# Altium project İHA-PDU.PrjPcb (part 5 of 13)
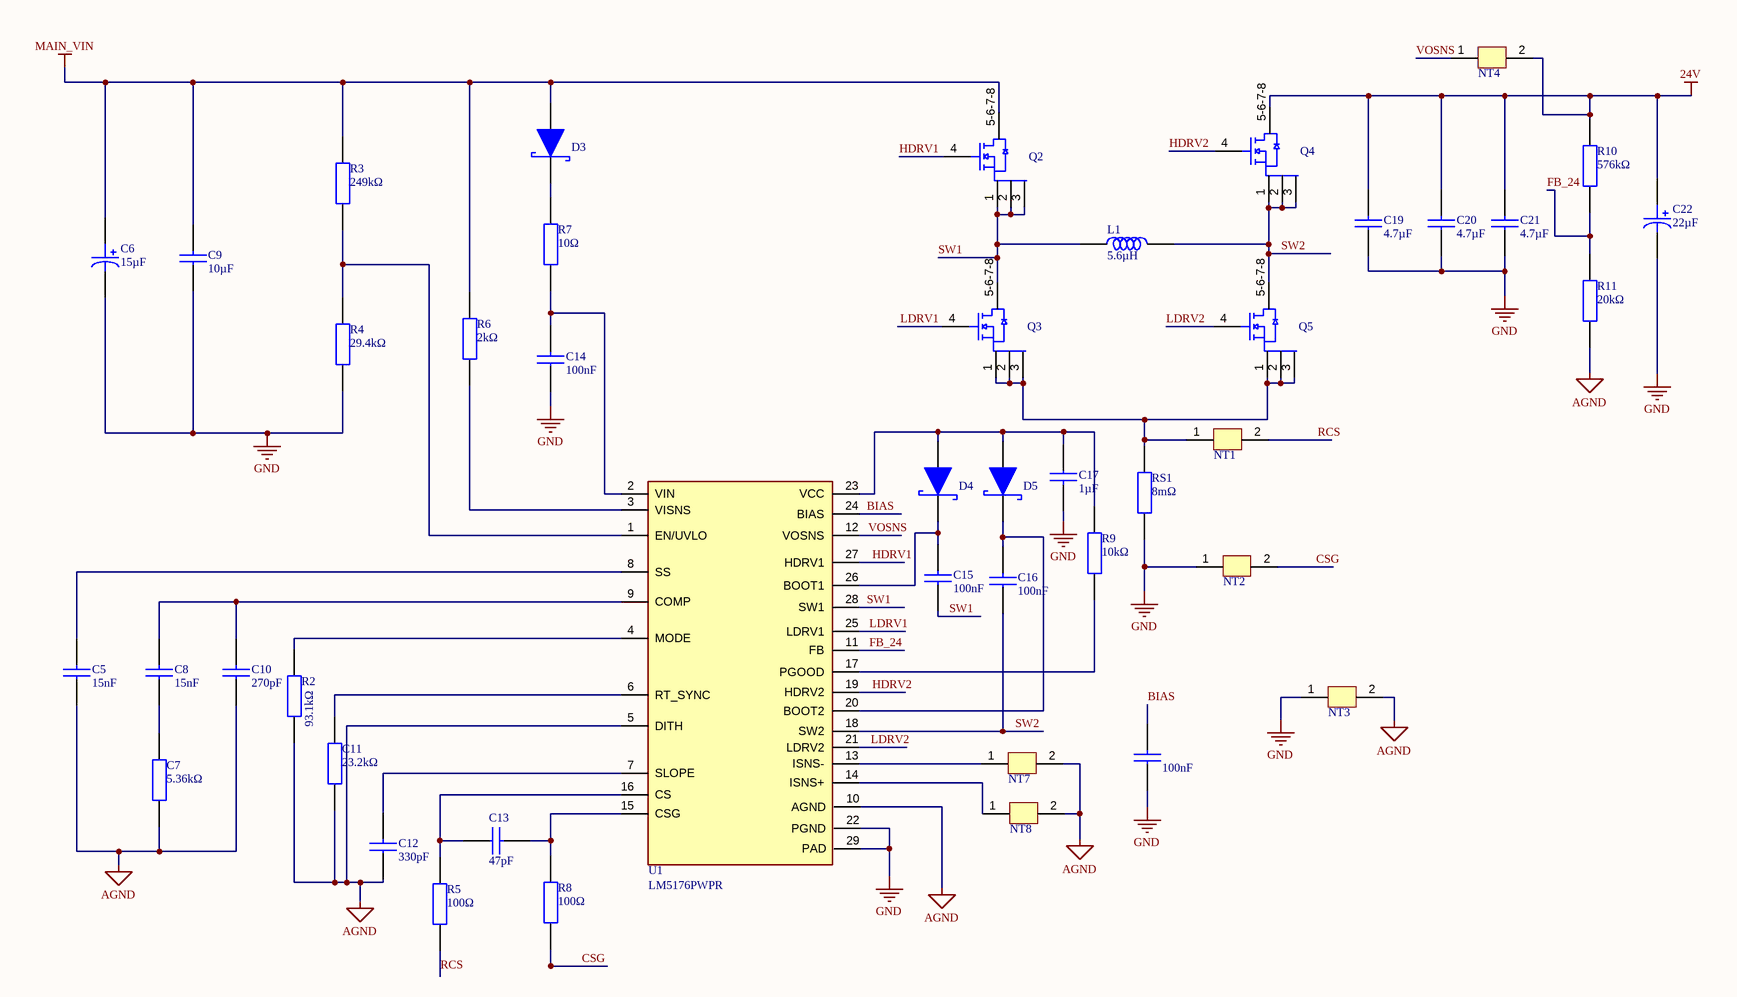
[diagram p11: 24V_Main_Regulator.SchDoc]

## Sheet 24V_Main_Regulator.SchDoc (continued)

### Library data of the parts (continued)
R6 = CRCW06032K00FKEA: 100mW Thick Film Resistors 100V ±1% ±100ppm/℃ 2kΩ 0603 Chip Resistor - Surface Mount ROHS; Manufacturer: Vishay; Temperature Coefficient: 100ppm/°C; Voltage Rating: 75V; Supplier: Farnell; Supplier Part Number: CRCW06032K00FKEA; Manufacturer Part Number: CRCW06032K00FKEA; RoHS: Compliant; Category: Chip SMD Resistors; Stock: 1445000; Pricing: 5000=0,0098 (EUR); Case/Package: 0603; Case Code (Imperial): 0603; China RoHS: Non-Compliant; Composition: Thick Film; Contact Plating: Lead, Tin; Country of Origin: Israel, Taiwan; Depth: 850µm; Export Control Classification Number (ECCN) Code: EAR99; Features: Automotive AEC-Q200; Height: 450µm; Harmonized Tariff Schedule (HTS) Code: 8533.21.00.30; Introduction Date: 2005-02-16; Lead Free: Lead Free; Length: 1.55mm; Lifecycle Status: Production; Max Operating Temperature: 155°C; Max Power Dissipation: 100mW; Military Standard: Not; Min Operating Temperature: -55°C; Mounting Technology: Surface Mount; Pins: 2; Number of Terminals: 2; Number of Terminations: 2; Packaging: Cut Tape; Power Rating: 100mW; Radiation Hardening: No; Ratings: AEC-Q200; REACH SVHC: Yes; Schedule B: 8533210045, 8533210045|8533210045|8533210045|8533210045|8533210045|8533210045|8533210045|8533210045|8533210045|8533210045|8533210045|8533210045|8533210045|8533210045|8533210045|8533210045|8533210045|8533210045|8533210045|8533210045|8533210045|8533210045|8533210045|85; Termination: Solder; Tolerance: 1%; Voltage Rating (DC): 75V; Weight: 2.012816mg; Width: 850µm; Working Voltage: 75V; ComponentLink1URL: https://datasheet.octopart.com:443/CRCW06032K00FKEA-Vishay-datasheet-175423584.pdf?src-supplier=IHS; ComponentLink1Description: https://datasheet.octopart.com:443/CRCW06032K00FKEA-Vishay-datasheet-175423584.pdf?src-supplier=IHS; ComponentLink2URL: https://datasheet.octopart.com:443/CRCW06032K00FKEA-Vishay-datasheet-62316122.pdf?src-supplier=Future+Electronics; ComponentLink2Description: https://datasheet.octopart.com:443/CRCW06032K00FKEA-Vishay-datasheet-62316122.pdf?src-supplier=Future+Electronics; ComponentLink3URL: https://datasheet.octopart.com:443/CRCW06032K00FKEA-Vishay-datasheet-5300368.pdf?src-supplier=Future+Electronics; ComponentLink3Description: https://datasheet.octopart.com:443/CRCW06032K00FKEA-Vishay-datasheet-5300368.pdf?src-supplier=Future+Electronics; ComponentLink4URL: https://datasheet.octopart.com:443/CRCW06032K00FKEA-Vishay-datasheet-83961561.pdf?src-supplier=element14+APAC; ComponentLink4Description: https://datasheet.octopart.com:443/CRCW06032K00FKEA-Vishay-datasheet-83961561.pdf?src-supplier=element14+APAC; ComponentLink5URL: https://datasheet.octopart.com:443/CRCW06032K00FKEA-Vishay-datasheet-62317933.pdf?src-supplier=element14+APAC; ComponentLink5Description: https://datasheet.octopart.com:443/CRCW06032K00FKEA-Vishay-datasheet-62317933.pdf?src-supplier=element14+APAC; ComponentLink6URL: https://datasheet.octopart.com:443/CRCW06032K00FKEA-Vishay-datasheet-14722531.pdf?src-supplier=element14+APAC; ComponentLink6Description: https://datasheet.octopart.com:443/CRCW06032K00FKEA-Vishay-datasheet-14722531.pdf?src-supplier=element14+APAC; ComponentLink7URL: https://datasheet.octopart.com:443/CRCW06032K00FKEA.-Vishay-datasheet-78776209.pdf?src-supplier=element14+APAC; ComponentLink7Description: https://datasheet.octopart.com:443/CRCW06032K00FKEA.-Vishay-datasheet-78776209.pdf?src-supplier=element14+APAC; ComponentLink8URL: https://datasheet.octopart.com:443/CRCW06032K00FKEA-Vishay-datasheet-66077789.pdf?src-supplier=element14+APAC; ComponentLink8Description: https://datasheet.octopart.com:443/CRCW06032K00FKEA-Vishay-datasheet-66077789.pdf?src-supplier=element14+APAC; ComponentLink9URL: https://datasheet.octopart.com:443/CRCW06032K00FKEA-Vishay-datasheet-16179825.pdf?src-supplier=element14+APAC; ComponentLink9Description: https://datasheet.octopart.com:443/CRCW06032K00FKEA-Vishay-datasheet-16179825.pdf?src-supplier=element14+APAC; ComponentLink10URL: https://datasheet.octopart.com:443/CRCW06032K00FKEA-Vishay-datasheet-11516975.pdf?src-supplier=Newark; ComponentLink10Description: https://datasheet.octopart.com:443/CRCW06032K00FKEA-Vishay-datasheet-11516975.pdf?src-supplier=Newark; ComponentLink11URL: https://datasheet.octopart.com:443/CRCW06032K00FKEA-Vishay-datasheet-41302739.pdf?src-supplier=Newark; ComponentLink11Description: https://datasheet.octopart.com:443/CRCW06032K00FKEA-Vishay-datasheet-41302739.pdf?src-supplier=Newark; ComponentLink12URL: https://datasheet.octopart.com:443/CRCW06032K00FKEA-Vishay-datasheet-27121962.pdf?src-supplier=Newark; ComponentLink12Description: https://datasheet.octopart.com:443/CRCW06032K00FKEA-Vishay-datasheet-27121962.pdf?src-supplier=Newark; ComponentLink13URL: https://datasheet.octopart.com:443/CRCW06032K00FKEA-Vishay-datasheet-5306405.pdf?src-supplier=RS+(Formerly+Allied+Electronics); ComponentLink13Description: https://datasheet.octopart.com:443/CRCW06032K00FKEA-Vishay-datasheet-5306405.pdf?src-supplier=RS+(Formerly+Allied+Electronics); ComponentLink14URL: https://datasheet.octopart.com:443/CRCW06032K00FKEA-Vishay-Dale-datasheet-47688880.pdf?src-supplier=RS+(Formerly+Allied+Electronics); ComponentLink14Description: https://datasheet.octopart.com:443/CRCW06032K00FKEA-Vishay-Dale-datasheet-47688880.pdf?src-supplier=RS+(Formerly+Allied+Electronics); ComponentLink15URL: https://datasheet.octopart.com:443/CRCW06032K00FKEA-Vishay-datasheet-12001583.pdf?src-supplier=RS+(Formerly+Allied+Electronics); ComponentLink15Description: https://datasheet.octopart.com:443/CRCW06032K00FKEA-Vishay-datasheet-12001583.pdf?src-supplier=RS+(Formerly+Allied+Electronics); ComponentLink16URL: https://datasheet.octopart.com:443/CRCW06032K00FKEA-Vishay-datasheet-5299586.pdf?src-supplier=Farnell; ComponentLink16Description: https://datasheet.octopart.com:443/CRCW06032K00FKEA-Vishay-datasheet-5299586.pdf?src-supplier=Farnell; ComponentLink17URL: https://datasheet.octopart.com:443/CRCW06032K00FKEA-Vishay-datasheet-10380026.pdf?src-supplier=Farnell; ComponentLink17Description: https://datasheet.octopart.com:443/CRCW06032K00FKEA-Vishay-datasheet-10380026.pdf?src-supplier=Farnell; ComponentLink18URL: https://datasheet.octopart.com:443/CRCW06032K00FKEA-Vishay-datasheet-13242068.pdf?src-supplier=Farnell; ComponentLink18Description: https://datasheet.octopart.com:443/CRCW06032K00FKEA-Vishay-datasheet-13242068.pdf?src-supplier=Farnell; ComponentLink19URL: https://datasheet.octopart.com:443/CRCW06032K00FKEA-Vishay-datasheet-13195083.pdf?src-supplier=Farnell; ComponentLink19Description: https://datasheet.octopart.com:443/CRCW06032K00FKEA-Vishay-datasheet-13195083.pdf?src-supplier=Farnell; ComponentLink20URL: https://datasheet.octopart.com:443/CRCW06032K00FKEA-Vishay-datasheet-13034211.pdf?src-supplier=Farnell; ComponentLink20Description: https://datasheet.octopart.com:443/CRCW06032K00FKEA-Vishay-datasheet-13034211.pdf?src-supplier=Farnell; ComponentLink21URL: https://datasheet.octopart.com:443/CRCW06032K00FKEA-Vishay-datasheet-12600034.pdf?src-supplier=Farnell; ComponentLink21Description: https://datasheet.octopart.com:443/CRCW06032K00FKEA-Vishay-datasheet-12600034.pdf?src-supplier=Farnell; ComponentLink22URL: https://datasheet.octopart.com:443/CRCW06032K00FKEA-Vishay-datasheet-12532161.pdf?src-supplier=Farnell; ComponentLink22Description: https://datasheet.octopart.com:443/CRCW06032K00FKEA-Vishay-datasheet-12532161.pdf?src-supplier=Farnell; ComponentLink23URL: https://datasheet.octopart.com:443/CRCW06032K00FKEA-Vishay-datasheet-12517896.pdf?src-supplier=Farnell; ComponentLink23Description: https://datasheet.octopart.com:443/CRCW06032K00FKEA-Vishay-datasheet-12517896.pdf?src-supplier=Farnell; ComponentLink24URL: https://datasheet.octopart.com:443/CRCW06032K00FKEA-Vishay-datasheet-12509762.pdf?src-supplier=Farnell; ComponentLink24Description: https://datasheet.octopart.com:443/CRCW06032K00FKEA-Vishay-datasheet-12509762.pdf?src-supplier=Farnell; ComponentLink25URL: https://datasheet.octopart.com:443/CRCW06032K00FKEA-Vishay-datasheet-10322335.pdf?src-supplier=Farnell; ComponentLink25Description: https://datasheet.octopart.com:443/CRCW06032K00FKEA-Vishay-datasheet-10322335.pdf?src-supplier=Farnell; ComponentLink26URL: https://datasheet.octopart.com:443/CRCW06032K00FKEA-Vishay-datasheet-8788789.pdf?src-supplier=Farnell; ComponentLink26Description: https://datasheet.octopart.com:443/CRCW06032K00FKEA-Vishay-datasheet-8788789.pdf?src-supplier=Farnell; ComponentLink27URL: https://datasheet.octopart.com:443/CRCW06032K00FKEA-Vishay-datasheet-8361388.pdf?src-supplier=Farnell; ComponentLink27Description: https://datasheet.octopart.com:443/CRCW06032K00FKEA-Vishay-datasheet-8361388.pdf?src-supplier=Farnell; ComponentLink28URL: https://datasheet.octopart.com:443/CRCW06032K00FKEA-Vishay-datasheet-546287.pdf?src-supplier=Farnell; ComponentLink28Description: https://datasheet.octopart.com:443/CRCW06032K00FKEA-Vishay-datasheet-546287.pdf?src-supplier=Farnell; ComponentLink29URL: https://datasheet.octopart.com:443/CRCW06032K00FKEA-Vishay-datasheet-192322418.pdf?src-supplier=HQonline; ComponentLink29Description: https://datasheet.octopart.com:443/CRCW06032K00FKEA-Vishay-datasheet-192322418.pdf?src-supplier=HQonline; ComponentLink30URL: https://datasheet.octopart.com:443/CRCW06032K00FKEA-Vishay-datasheet-17834126.pdf?src-supplier=TME; ComponentLink30Description: https://datasheet.octopart.com:443/CRCW06032K00FKEA-Vishay-datasheet-17834126.pdf?src-supplier=TME; ComponentLink31URL: https://datasheet.octopart.com:443/CRCW06032K00FKEA-Vishay-datasheet-11540273.pdf?src-supplier=Arrow+Electronics; ComponentLink31Description: https://datasheet.octopart.com:443/CRCW06032K00FKEA-Vishay-datasheet-11540273.pdf?src-supplier=Arrow+Electronics; ComponentLink32URL: https://datasheet.octopart.com:443/CRCW06032K00FKEA-Vishay-datasheet-8445837.pdf?src-supplier=element14; ComponentLink32Description: https://datasheet.octopart.com:443/CRCW06032K00FKEA-Vishay-datasheet-8445837.pdf?src-supplier=element14; ComponentLink33URL: https://datasheet.octopart.com:443/CRCW06032K00FKEA-Vishay-datasheet-5377433.pdf?src-supplier=Garrett; ComponentLink33Description: https://datasheet.octopart.com:443/CRCW06032K00FKEA-Vishay-datasheet-5377433.pdf?src-supplier=Garrett; ComponentLink34URL: https://datasheet.octopart.com:443/CRCW06032K00FKEA-Vishay-datasheet-148188.pdf?src-supplier=Garrett; ComponentLink34Description: https://datasheet.octopart.com:443/CRCW06032K00FKEA-Vishay-datasheet-148188.pdf?src-supplier=Garrett; ComponentLink35URL: https://datasheet.octopart.com:443/CRCW06032K00FKEA-Vishay-datasheet-30224.pdf?src-supplier=Garrett; ComponentLink35Description: https://datasheet.octopart.com:443/CRCW06032K00FKEA-Vishay-datasheet-30224.pdf?src-supplier=Garrett; ComponentLink36URL: http://sigma.octopart.com:80/rohs_statement/Vishay-company-15.pdf?src-supplier=Compliance+Statements; ComponentLink36Description: http://sigma.octopart.com:80/rohs_statement/Vishay-company-15.pdf?src-supplier=Compliance+Statements
R7 = RC0603FR-0710RL: Res Thick Film 0603 10 Ohm 1% 0.1W(1/10W) ±200ppm/C Pad SMD T/R; Manufacturer: Yageo Group; Power Rating: 100mW; Temperature Coefficient: 200ppm/°C; Voltage Rating: 50V; Working Voltage: 75V; Supplier: Farnell; Supplier Part Number: RC0603FR-0710RL; Manufacturer Part Number: RC0603FR-0710RL; RoHS: Compliant; Category: Chip SMD Resistors; Stock: 404908; Pricing: 10=0,0095, 100=0,0086, 500=0,0075, 1000=0,0065, 2500=0,0054, 5000=0,0043 (EUR); Case/Package: 0603; Case Code (Imperial): 0603; Case Code (Metric): 0603; China RoHS: Non-Compliant; Composition: Thick Film; Contact Plating: Tin; Country of Origin: Mainland China, Taiwan; Depth: 800µm; Export Control Classification Number (ECCN) Code: EAR99; Height: 450µm; Harmonized Tariff Schedule (HTS) Code: 8533.21.00.30; Introduction Date: 2004-09-22; Lead Free: Lead Free; Length: 1.6mm; Lifecycle Status: Production; Max Operating Temperature: 155°C; Military Standard: Not; Min Operating Temperature: -55°C; Mounting Technology: Surface Mount; Pins: 2; Number of Terminals: 2; Packaging: Tape and Reel; Radiation Hardening: No; REACH SVHC: Yes; Schedule B: 8533210045, 8533210045|8533210045|8533210045|8533210045|8533210045|8533210045|8533210045|8533210045|8533210045|8533210045|8533210045|8533210045|8533210045|8533210045|8533210045|8533210045|8533210045|8533210045|8533210045|8533210045|8533210045|8533210045|8533210045|85; Termination: SMD/SMT; Tolerance: 1%; Voltage Rating (AC): 50V; Voltage Rating (DC): 50V; Width: 800µm; ComponentLink1URL: https://datasheet.octopart.com:443/RC0603FR-0710RL-Yageo-datasheet-175887523.pdf?src-supplier=IHS; ComponentLink1Description: https://datasheet.octopart.com:443/RC0603FR-0710RL-Yageo-datasheet-175887523.pdf?src-supplier=IHS; ComponentLink2URL: https://datasheet.octopart.com:443/RC0603FR-0710RL-Yageo-datasheet-62067350.pdf?src-supplier=Farnell; ComponentLink2Description: https://datasheet.octopart.com:443/RC0603FR-0710RL-Yageo-datasheet-62067350.pdf?src-supplier=Farnell; ComponentLink3URL: https://datasheet.octopart.com:443/RC0603FR-0710RL-Yageo-datasheet-13691069.pdf?src-supplier=Farnell; ComponentLink3Description: https://datasheet.octopart.com:443/RC0603FR-0710RL-Yageo-datasheet-13691069.pdf?src-supplier=Farnell; ComponentLink4URL: https://datasheet.octopart.com:443/RC0603FR-0710RL-Yageo-datasheet-103092701.pdf?src-supplier=Upverter; ComponentLink4Description: https://datasheet.octopart.com:443/RC0603FR-0710RL-Yageo-datasheet-103092701.pdf?src-supplier=Upverter; ComponentLink5URL: https://datasheet.octopart.com:443/RC0603FR-0710RL-Yageo-datasheet-98239111.pdf?src-supplier=Upverter; ComponentLink5Description: https://datasheet.octopart.com:443/RC0603FR-0710RL-Yageo-datasheet-98239111.pdf?src-supplier=Upverter; ComponentLink6URL: https://datasheet.octopart.com:443/RC0603FR-0710RL-Yageo-datasheet-79472498.pdf?src-supplier=Upverter; ComponentLink6Description: https://datasheet.octopart.com:443/RC0603FR-0710RL-Yageo-datasheet-79472498.pdf?src-supplier=Upverter; ComponentLink7URL: https://datasheet.octopart.com:443/RC0603FR-0710RL-Yageo-datasheet-8328172.pdf?src-supplier=element14+APAC; ComponentLink7Description: https://datasheet.octopart.com:443/RC0603FR-0710RL-Yageo-datasheet-8328172.pdf?src-supplier=element14+APAC; ComponentLink8URL: https://datasheet.octopart.com:443/RC0603FR-0710RL-Yageo-Group-datasheet-176638170.pdf?src-supplier=Future+Electronics; ComponentLink8Description: https://datasheet.octopart.com:443/RC0603FR-0710RL-Yageo-Group-datasheet-176638170.pdf?src-supplier=Future+Electronics; ComponentLink9URL: https://datasheet.octopart.com:443/RC0603FR-0710RL-Yageo-datasheet-164759695.pdf?src-supplier=Future+Electronics; ComponentLink9Description: https://datasheet.octopart.com:443/RC0603FR-0710RL-Yageo-datasheet-164759695.pdf?src-supplier=Future+Electronics; ComponentLink10URL: https://datasheet.octopart.com:443/RC0603FR-0710RL-Yageo-datasheet-137700087.pdf?src-supplier=Future+Electronics; ComponentLink10Description: https://datasheet.octopart.com:443/RC0603FR-0710RL-Yageo-datasheet-137700087.pdf?src-supplier=Future+Electronics; ComponentLink11URL: https://datasheet.octopart.com:443/RC0603FR-0710RL-Yageo-datasheet-27584510.pdf?src-supplier=Future+Electronics; ComponentLink11Description: https://datasheet.octopart.com:443/RC0603FR-0710RL-Yageo-datasheet-27584510.pdf?src-supplier=Future+Electronics; ComponentLink12URL: https://datasheet.octopart.com:443/RC0603FR-0710RL-Yageo-datasheet-15599030.pdf?src-supplier=Future+Electronics; ComponentLink12Description: https://datasheet.octopart.com:443/RC0603FR-0710RL-Yageo-datasheet-15599030.pdf?src-supplier=Future+Electronics; ComponentLink13URL: https://datasheet.octopart.com:443/RC0603FR-0710RL-Yageo-datasheet-12596169.pdf?src-supplier=Future+Electronics; ComponentLink13Description: https://datasheet.octopart.com:443/RC0603FR-0710RL-Yageo-datasheet-12596169.pdf?src-supplier=Future+Electronics; ComponentLink14URL: https://datasheet.octopart.com:443/RC0603FR-0710RL-Yageo-datasheet-8324193.pdf?src-supplier=Future+Electronics; ComponentLink14Description: https://datasheet.octopart.com:443/RC0603FR-0710RL-Yageo-datasheet-8324193.pdf?src-supplier=Future+Electronics; ComponentLink15URL: https://datasheet.octopart.com:443/RC0603FR-0710RL-Yageo-datasheet-34211833.pdf?src-supplier=Newark; ComponentLink15Description: https://datasheet.octopart.com:443/RC0603FR-0710RL-Yageo-datasheet-34211833.pdf?src-supplier=Newark; ComponentLink16URL: https://datasheet.octopart.com/RC0603FR-0710RL-Yageo-datasheet-73766026.pdf; ComponentLink16Description: https://datasheet.octopart.com/RC0603FR-0710RL-Yageo-datasheet-73766026.pdf; ComponentLink17URL: https://datasheet.octopart.com:443/RC0603FR-0710RL-Yageo-datasheet-30459151.pdf?src-supplier=Seeed+Studio; ComponentLink17Description: https://datasheet.octopart.com:443/RC0603FR-0710RL-Yageo-datasheet-30459151.pdf?src-supplier=Seeed+Studio; ComponentLink18URL: https://datasheet.octopart.com:443/RC0603FR-0710RL-Yageo-datasheet-14181472.pdf?src-supplier=iiiC; ComponentLink18Description: https://datasheet.octopart.com:443/RC0603FR-0710RL-Yageo-datasheet-14181472.pdf?src-supplier=iiiC; ComponentLink19URL: https://datasheet.octopart.com:443/RC0603FR-0710RL-Yageo-datasheet-118562.pdf?src-supplier=DigiKey; ComponentLink19Description: https://datasheet.octopart.com:443/RC0603FR-0710RL-Yageo-datasheet-118562.pdf?src-supplier=DigiKey; ComponentLink20URL: http://sigma.octopart.com:80/conflict_mineral_statement/Yageo-company-3.pdf?src-supplier=Compliance+Statements; ComponentLink20Description: http://sigma.octopart.com:80/conflict_mineral_statement/Yageo-company-3.pdf?src-supplier=Compliance+Statements; ComponentLink21URL: http://sigma.octopart.com:80/rohs_statement/Yageo-company-2.pdf?src-supplier=Compliance+Statements; ComponentLink21Description: http://sigma.octopart.com:80/rohs_statement/Yageo-company-2.pdf?src-supplier=Compliance+Statements
R9 = RC0603FR-0710KL: 100mW Thick Film Resistors 75V ±100ppm/℃ ±1% 10kΩ 0603 Chip Resistor - Surface Mount ROHS; Manufacturer: Yageo Group; Temperature Coefficient: 100ppm/°C; Voltage Rating (DC): 50V; Supplier: Farnell; Supplier Part Number: RC0603FR-0710KL; Manufacturer Part Number: RC0603FR-0710KL; RoHS: Compliant; Category: Chip SMD Resistors; Stock: 11423000; Pricing: 5000=0,0037 (EUR); Case/Package: 0603; Case Code (Imperial): 0603; Case Code (Metric): 0603; China RoHS: Non-Compliant; Composition: Thick Film; Contact Plating: Tin; Depth: 800µm; Height: 450µm; Lead Free: Lead Free; Lead Pitch: 300µm; Length: 1.6mm; Lifecycle Status: Production; Max Operating Temperature: 155°C; Military Standard: Not; Min Operating Temperature: -55°C; Mounting Technology: Surface Mount; Pins: 2; Number of Terminals: 2; Packaging: Tape & Reel; Power Rating: 100mW; Radiation Hardening: No; REACH SVHC: Yes; Schedule B: 8533210045, 8533210045|8533210045|8533210045|8533210045|8533210045|8533210045|8533210045|8533210045|8533210045|8533210045|8533210045|8533210045|8533210045|8533210045|8533210045|8533210045|8533210045|8533210045|8533210045|8533210045|8533210045|8533210045|8533210045|85; Termination: SMD/SMT; Tolerance: 1%; Voltage Rating: 75V; Weight: 2.012816mg; Width: 800µm; Working Voltage: 75V; ComponentLink1URL: https://datasheet.octopart.com:443/RC0603FR-0710KL-Yageo-datasheet-175887523.pdf?src-supplier=IHS; ComponentLink1Description: https://datasheet.octopart.com:443/RC0603FR-0710KL-Yageo-datasheet-175887523.pdf?src-supplier=IHS; ComponentLink2URL: https://datasheet.octopart.com:443/RC0603FR-0710KL-Yageo-datasheet-103092701.pdf?src-supplier=Upverter; ComponentLink2Description: https://datasheet.octopart.com:443/RC0603FR-0710KL-Yageo-datasheet-103092701.pdf?src-supplier=Upverter; ComponentLink3URL: https://datasheet.octopart.com:443/RC0603FR-0710KL-Yageo-datasheet-98239111.pdf?src-supplier=Upverter; ComponentLink3Description: https://datasheet.octopart.com:443/RC0603FR-0710KL-Yageo-datasheet-98239111.pdf?src-supplier=Upverter; ComponentLink4URL: https://datasheet.octopart.com:443/RC0603FR-0710KL-Yageo-datasheet-141265859.pdf?src-supplier=Upverter; ComponentLink4Description: https://datasheet.octopart.com:443/RC0603FR-0710KL-Yageo-datasheet-141265859.pdf?src-supplier=Upverter; ComponentLink5URL: https://sigma.octopart.com:443/138820526/technical_drawing/Yageo-RC0603FR-0710KL.pdf?src-supplier=Upverter; ComponentLink5Description: https://sigma.octopart.com:443/138820526/technical_drawing/Yageo-RC0603FR-0710KL.pdf?src-supplier=Upverter; ComponentLink6URL: https://datasheet.octopart.com:443/RC0603FR-0710KL-Yageo-datasheet-8328172.pdf?src-supplier=Farnell; ComponentLink6Description: https://datasheet.octopart.com:443/RC0603FR-0710KL-Yageo-datasheet-8328172.pdf?src-supplier=Farnell; ComponentLink7URL: https://datasheet.octopart.com:443/RC0603FR-0710KL-Yageo-datasheet-13691069.pdf?src-supplier=Farnell; ComponentLink7Description: https://datasheet.octopart.com:443/RC0603FR-0710KL-Yageo-datasheet-13691069.pdf?src-supplier=Farnell; ComponentLink8URL: https://datasheet.octopart.com:443/RC0603FR-0710KL-Yageo-datasheet-62067350.pdf?src-supplier=element14+APAC; ComponentLink8Description: https://datasheet.octopart.com:443/RC0603FR-0710KL-Yageo-datasheet-62067350.pdf?src-supplier=element14+APAC; ComponentLink9URL: https://datasheet.octopart.com:443/RC0603FR-0710KL-Yageo-datasheet-17842380.pdf?src-supplier=element14+APAC; ComponentLink9Description: https://datasheet.octopart.com:443/RC0603FR-0710KL-Yageo-datasheet-17842380.pdf?src-supplier=element14+APAC; ComponentLink10URL: https://datasheet.octopart.com:443/RC0603FR-0710KL-Yageo-datasheet-15599030.pdf?src-supplier=Future+Electronics; ComponentLink10Description: https://datasheet.octopart.com:443/RC0603FR-0710KL-Yageo-datasheet-15599030.pdf?src-supplier=Future+Electronics; ComponentLink11URL: https://datasheet.octopart.com:443/RC0603FR-0710KL-Yageo-Group-datasheet-176638170.pdf?src-supplier=Future+Electronics; ComponentLink11Description: https://datasheet.octopart.com:443/RC0603FR-0710KL-Yageo-Group-datasheet-176638170.pdf?src-supplier=Future+Electronics; ComponentLink12URL: https://datasheet.octopart.com:443/RC0603FR-0710KL-Yageo-datasheet-164759695.pdf?src-supplier=Future+Electronics; ComponentLink12Description: https://datasheet.octopart.com:443/RC0603FR-0710KL-Yageo-datasheet-164759695.pdf?src-supplier=Future+Electronics; ComponentLink13URL: https://datasheet.octopart.com:443/RC0603FR-0710KL-Yageo-datasheet-127823281.pdf?src-supplier=Future+Electronics; ComponentLink13Description: https://datasheet.octopart.com:443/RC0603FR-0710KL-Yageo-datasheet-127823281.pdf?src-supplier=Future+Electronics; ComponentLink14URL: https://datasheet.octopart.com:443/RC0603FR-0710KL-Yageo-datasheet-137700087.pdf?src-supplier=Future+Electronics; ComponentLink14Description: https://datasheet.octopart.com:443/RC0603FR-0710KL-Yageo-datasheet-137700087.pdf?src-supplier=Future+Electronics; ComponentLink15URL: https://datasheet.octopart.com:443/RC0603FR-0710KL-Yageo-datasheet-27584510.pdf?src-supplier=Future+Electronics; ComponentLink15Description: https://datasheet.octopart.com:443/RC0603FR-0710KL-Yageo-datasheet-27584510.pdf?src-supplier=Future+Electronics; ComponentLink16URL: https://datasheet.octopart.com:443/RC0603FR-0710KL-Yageo-datasheet-8324193.pdf?src-supplier=Future+Electronics; ComponentLink16Description: https://datasheet.octopart.com:443/RC0603FR-0710KL-Yageo-datasheet-8324193.pdf?src-supplier=Future+Electronics; ComponentLink17URL: https://datasheet.octopart.com:443/RC0603FR-0710KL-Yageo-datasheet-12596169.pdf?src-supplier=Newark; ComponentLink17Description: https://datasheet.octopart.com:443/RC0603FR-0710KL-Yageo-datasheet-12596169.pdf?src-supplier=Newark; ComponentLink18URL: https://datasheet.octopart.com:443/RC0603FR-0710KL-Yageo-datasheet-503470.pdf?src-supplier=Newark; ComponentLink18Description: https://datasheet.octopart.com:443/RC0603FR-0710KL-Yageo-datasheet-503470.pdf?src-supplier=Newark; ComponentLink19URL: https://datasheet.octopart.com:443/RC0603FR-0710KL-Yageo-datasheet-34211833.pdf?src-supplier=Newark; ComponentLink19Description: https://datasheet.octopart.com:443/RC0603FR-0710KL-Yageo-datasheet-34211833.pdf?src-supplier=Newark; ComponentLink20URL: https://datasheet.octopart.com:443/RC0603FR-0710KL-Yageo-datasheet-79472498.pdf?src-supplier=Megastar; ComponentLink20Description: https://datasheet.octopart.com:443/RC0603FR-0710KL-Yageo-datasheet-79472498.pdf?src-supplier=Megastar; ComponentLink21URL: https://datasheet.octopart.com/RC0603FR-0710KL-Yageo-datasheet-73766026.pdf; ComponentLink21Description: https://datasheet.octopart.com/RC0603FR-0710KL-Yageo-datasheet-73766026.pdf; ComponentLink22URL: https://datasheet.octopart.com:443/RC0603FR-0710KL-Yageo-datasheet-118562.pdf?src-supplier=DigiKey; ComponentLink22Description: https://datasheet.octopart.com:443/RC0603FR-0710KL-Yageo-datasheet-118562.pdf?src-supplier=DigiKey; ComponentLink23URL: http://sigma.octopart.com:80/conflict_mineral_statement/Yageo-company-3.pdf?src-supplier=Compliance+Statements; ComponentLink23Description: http://sigma.octopart.com:80/conflict_mineral_statement/Yageo-company-3.pdf?src-supplier=Compliance+Statements; ComponentLink24URL: http://sigma.octopart.com:80/rohs_statement/Yageo-company-2.pdf?src-supplier=Compliance+Statements; ComponentLink24Description: http://sigma.octopart.com:80/rohs_statement/Yageo-company-2.pdf?src-supplier=Compliance+Statements
R10 = RC0603FR-07576KL: Res Thick Film 0603 576K Ohm 1% 0.1W(1/10W) ±100ppm/C Pad SMD T/R; Manufacturer: Yageo Group; Max Power Dissipation: 100mW; Temperature Coefficient: 100ppm/°C; Voltage Rating: 75V; Voltage Rating (DC): 50V; Supplier: Farnell; Supplier Part Number: RC0603FR-07576KL; Manufacturer Part Number: RC0603FR-07576KL; RoHS: Compliant; Category: Chip SMD Resistors; Stock: 6680; Pricing: 10=0,0057, 100=0,0047, 500=0,0045, 1000=0,0044, 2500=0,0042 (EUR); Case/Package: 0603; Case Code (Imperial): 0603; China RoHS: Non-Compliant; Composition: Thick Film; Contact Plating: Tin; Depth: 800µm; Features: Moisture Resistant; Height: 450µm; Lead Free: Lead Free; Length: 1.6mm; Lifecycle Status: Production; Max Operating Temperature: 155°C; Military Standard: Not; Min Operating Temperature: -55°C; Mounting Technology: Surface Mount; Number of Terminals: 2; Number of Terminations: 2; Power Rating: 100mW; REACH SVHC: Yes; Schedule B: 8533210045, 8533210045|8533210045|8533210045|8533210045|8533210045|8533210045|8533210045|8533210045|8533210045|8533210045|8533210045|8533210045|8533210045, 8533210045|8533210045|8533210045|8533210045|8533210045|8533210045|8533210045|8533210045|8533210045|8533210045|8533210045|8533210045|8533210045|8533210045, 8533210045|8533210045|8533210045|8533210045|8533210045|8533210045|8533210045|8533210045|8533210045|8533210045|8533210045|8533210045|8533210045|8533210045|8533210045; Termination: SMD/SMT; Tolerance: 1%; Width: 800µm; Working Voltage: 75V; ComponentLink1URL: https://datasheet.octopart.com:443/RC0603FR-07576KL-Yageo-datasheet-175887523.pdf?src-supplier=IHS; ComponentLink1Description: https://datasheet.octopart.com:443/RC0603FR-07576KL-Yageo-datasheet-175887523.pdf?src-supplier=IHS; ComponentLink2URL: https://datasheet.octopart.com:443/RC0603FR-07576KL-Yageo-datasheet-103092701.pdf?src-supplier=Upverter; ComponentLink2Description: https://datasheet.octopart.com:443/RC0603FR-07576KL-Yageo-datasheet-103092701.pdf?src-supplier=Upverter; ComponentLink3URL: https://datasheet.octopart.com:443/RC0603FR-07576KL-Yageo-datasheet-8328172.pdf?src-supplier=_legacy+Avnet; ComponentLink3Description: https://datasheet.octopart.com:443/RC0603FR-07576KL-Yageo-datasheet-8328172.pdf?src-supplier=_legacy+Avnet; ComponentLink4URL: https://datasheet.octopart.com:443/RC0603FR-07576KL-Yageo-Group-datasheet-176638170.pdf?src-supplier=Future+Electronics; ComponentLink4Description: https://datasheet.octopart.com:443/RC0603FR-07576KL-Yageo-Group-datasheet-176638170.pdf?src-supplier=Future+Electronics; ComponentLink5URL: https://datasheet.octopart.com:443/RC0603FR-07576KL-Yageo-datasheet-164759695.pdf?src-supplier=Future+Electronics; ComponentLink5Description: https://datasheet.octopart.com:443/RC0603FR-07576KL-Yageo-datasheet-164759695.pdf?src-supplier=Future+Electronics; ComponentLink6URL: https://datasheet.octopart.com:443/RC0603FR-07576KL-Yageo-datasheet-127823281.pdf?src-supplier=Future+Electronics; ComponentLink6Description: https://datasheet.octopart.com:443/RC0603FR-07576KL-Yageo-datasheet-127823281.pdf?src-supplier=Future+Electronics; ComponentLink7URL: https://datasheet.octopart.com:443/RC0603FR-07576KL-Yageo-datasheet-137700087.pdf?src-supplier=Future+Electronics; ComponentLink7Description: https://datasheet.octopart.com:443/RC0603FR-07576KL-Yageo-datasheet-137700087.pdf?src-supplier=Future+Electronics; ComponentLink8URL: https://datasheet.octopart.com:443/RC0603FR-07576KL-Yageo-datasheet-17842380.pdf?src-supplier=Future+Electronics; ComponentLink8Description: https://datasheet.octopart.com:443/RC0603FR-07576KL-Yageo-datasheet-17842380.pdf?src-supplier=Future+Electronics; ComponentLink9URL: https://datasheet.octopart.com:443/RC0603FR-07576KL-Yageo-datasheet-15599030.pdf?src-supplier=Future+Electronics; ComponentLink9Description: https://datasheet.octopart.com:443/RC0603FR-07576KL-Yageo-datasheet-15599030.pdf?src-supplier=Future+Electronics; ComponentLink10URL: https://datasheet.octopart.com:443/RC0603FR-07576KL-Yageo-datasheet-12596169.pdf?src-supplier=Future+Electronics; ComponentLink10Description: https://datasheet.octopart.com:443/RC0603FR-07576KL-Yageo-datasheet-12596169.pdf?src-supplier=Future+Electronics; ComponentLink11URL: https://datasheet.octopart.com/RC0603FR-07576KL-Yageo-datasheet-73766026.pdf; ComponentLink11Description: https://datasheet.octopart.com/RC0603FR-07576KL-Yageo-datasheet-73766026.pdf; ComponentLink12URL: https://datasheet.octopart.com:443/RC0603FR-07576KL-Yageo-datasheet-118562.pdf?src-supplier=DigiKey; ComponentLink12Description: https://datasheet.octopart.com:443/RC0603FR-07576KL-Yageo-datasheet-118562.pdf?src-supplier=DigiKey; ComponentLink13URL: http://sigma.octopart.com:80/conflict_mineral_statement/Yageo-company-3.pdf?src-supplier=Compliance+Statements; ComponentLink13Description: http://sigma.octopart.com:80/conflict_mineral_statement/Yageo-company-3.pdf?src-supplier=Compliance+Statements; ComponentLink14URL: http://sigma.octopart.com:80/rohs_statement/Yageo-company-2.pdf?src-supplier=Compliance+Statements; ComponentLink14Description: http://sigma.octopart.com:80/rohs_statement/Yageo-company-2.pdf?src-supplier=Compliance+Statements
R11 = RC0603FR-0720KL: 100mW Thick Film Resistors 75V ±100ppm/℃ ±1% 20kΩ 0603 Chip Resistor - Surface Mount ROHS; Manufacturer: Yageo Group; Temperature Coefficient: 100ppm/°C; Voltage Rating (DC): 50V; Supplier: Farnell; Supplier Part Number: RC0603FR-0720KL; Manufacturer Part Number: RC0603FR-0720KL; RoHS: Compliant; Category: Chip SMD Resistors; Stock: 240893; Pricing: 10=0,0067, 100=0,0057, 500=0,0056, 1000=0,0054, 2500=0,0042 (EUR); Case/Package: 0603; Case Code (Imperial): 0603; China RoHS: Non-Compliant; Composition: Thick Film; Contact Plating: Tin; Country of Origin: Mainland China, Taiwan; Depth: 800µm; Export Control Classification Number (ECCN) Code: EAR99; Features: Moisture Resistant; Height: 450µm; Harmonized Tariff Schedule (HTS) Code: 8533.21.00.30; Introduction Date: 2004-10-04; Lead Free: Lead Free; Length: 1.6mm; Lifecycle Status: Production; Max Operating Temperature: 155°C; Max Power Dissipation: 100mW; Military Standard: Not; Min Operating Temperature: -55°C; Mounting Technology: Surface Mount; Pins: 2; Number of Terminals: 2; Number of Terminations: 2; Packaging: Tape & Reel; Power Rating: 100mW; Radiation Hardening: No; REACH SVHC: Yes; Schedule B: 8533210045, 8533210045|8533210045|8533210045|8533210045|8533210045|8533210045|8533210045|8533210045|8533210045|8533210045|8533210045|8533210045|8533210045|8533210045, 8533210045|8533210045|8533210045|8533210045|8533210045|8533210045|8533210045|8533210045|8533210045|8533210045|8533210045|8533210045|8533210045|8533210045|8533210045, 8533210045|8533210045|8533210045|8533210045|8533210045|8533210045|8533210045|8533210045|8533210045|8533210045|8533210045|8533210045|8533210045|8533210045|8533210045|8533210045; Termination: SMD/SMT; Tolerance: 1%; Voltage Rating: 75V; Width: 800µm; Working Voltage: 75V; ComponentLink1URL: https://datasheet.octopart.com:443/RC0603FR-0720KL-Yageo-datasheet-175887523.pdf?src-supplier=IHS; ComponentLink1Description: https://datasheet.octopart.com:443/RC0603FR-0720KL-Yageo-datasheet-175887523.pdf?src-supplier=IHS; ComponentLink2URL: https://datasheet.octopart.com:443/RC0603FR-0720KL-Yageo-datasheet-141265859.pdf?src-supplier=Upverter; ComponentLink2Description: https://datasheet.octopart.com:443/RC0603FR-0720KL-Yageo-datasheet-141265859.pdf?src-supplier=Upverter; ComponentLink3URL: https://datasheet.octopart.com:443/RC0603FR-0720KL-Yageo-datasheet-103092701.pdf?src-supplier=Upverter; ComponentLink3Description: https://datasheet.octopart.com:443/RC0603FR-0720KL-Yageo-datasheet-103092701.pdf?src-supplier=Upverter; ComponentLink4URL: https://sigma.octopart.com:443/138820526/technical_drawing/Yageo-RC0603FR-0720KL.pdf?src-supplier=Upverter; ComponentLink4Description: https://sigma.octopart.com:443/138820526/technical_drawing/Yageo-RC0603FR-0720KL.pdf?src-supplier=Upverter; ComponentLink5URL: https://datasheet.octopart.com:443/RC0603FR-0720KL-Yageo-datasheet-8328172.pdf?src-supplier=Burklin+Elektronik; ComponentLink5Description: https://datasheet.octopart.com:443/RC0603FR-0720KL-Yageo-datasheet-8328172.pdf?src-supplier=Burklin+Elektronik; ComponentLink6URL: https://datasheet.octopart.com:443/RC0603FR-0720KL-Yageo-Group-datasheet-190305687.pdf?src-supplier=Newark; ComponentLink6Description: https://datasheet.octopart.com:443/RC0603FR-0720KL-Yageo-Group-datasheet-190305687.pdf?src-supplier=Newark; ComponentLink7URL: https://datasheet.octopart.com:443/RC0603FR-0720KL-Yageo-datasheet-34211833.pdf?src-supplier=element14+APAC; ComponentLink7Description: https://datasheet.octopart.com:443/RC0603FR-0720KL-Yageo-datasheet-34211833.pdf?src-supplier=element14+APAC; ComponentLink8URL: https://datasheet.octopart.com:443/RC0603FR-0720KL-Yageo-datasheet-62067350.pdf?src-supplier=Farnell; ComponentLink8Description: https://datasheet.octopart.com:443/RC0603FR-0720KL-Yageo-datasheet-62067350.pdf?src-supplier=Farnell; ComponentLink9URL: https://datasheet.octopart.com:443/RC0603FR-0720KL-Yageo-Group-datasheet-176638170.pdf?src-supplier=Future+Electronics; ComponentLink9Description: https://datasheet.octopart.com:443/RC0603FR-0720KL-Yageo-Group-datasheet-176638170.pdf?src-supplier=Future+Electronics; ComponentLink10URL: https://datasheet.octopart.com:443/RC0603FR-0720KL-Yageo-datasheet-164759695.pdf?src-supplier=Future+Electronics; ComponentLink10Description: https://datasheet.octopart.com:443/RC0603FR-0720KL-Yageo-datasheet-164759695.pdf?src-supplier=Future+Electronics; ComponentLink11URL: https://datasheet.octopart.com:443/RC0603FR-0720KL-Yageo-datasheet-137700087.pdf?src-supplier=Future+Electronics; ComponentLink11Description: https://datasheet.octopart.com:443/RC0603FR-0720KL-Yageo-datasheet-137700087.pdf?src-supplier=Future+Electronics; ComponentLink12URL: https://datasheet.octopart.com:443/RC0603FR-0720KL-Yageo-datasheet-15599030.pdf?src-supplier=Future+Electronics; ComponentLink12Description: https://datasheet.octopart.com:443/RC0603FR-0720KL-Yageo-datasheet-15599030.pdf?src-supplier=Future+Electronics; ComponentLink13URL: https://datasheet.octopart.com:443/RC0603FR-0720KL-Yageo-datasheet-12596169.pdf?src-supplier=Future+Electronics; ComponentLink13Description: https://datasheet.octopart.com:443/RC0603FR-0720KL-Yageo-datasheet-12596169.pdf?src-supplier=Future+Electronics; ComponentLink14URL: https://datasheet.octopart.com:443/RC0603FR-0720KL-Yageo-datasheet-8324193.pdf?src-supplier=Future+Electronics; ComponentLink14Description: https://datasheet.octopart.com:443/RC0603FR-0720KL-Yageo-datasheet-8324193.pdf?src-supplier=Future+Electronics; ComponentLink15URL: https://datasheet.octopart.com:443/RC0603FR-0720KL-Yageo-datasheet-79472498.pdf?src-supplier=Megastar; ComponentLink15Description: https://datasheet.octopart.com:443/RC0603FR-0720KL-Yageo-datasheet-79472498.pdf?src-supplier=Megastar; ComponentLink16URL: https://datasheet.octopart.com/RC0603FR-0720KL-Yageo-datasheet-73766026.pdf; ComponentLink16Description: https://datasheet.octopart.com/RC0603FR-0720KL-Yageo-datasheet-73766026.pdf; ComponentLink17URL: https://datasheet.octopart.com:443/RC0603FR-0720KL-Yageo-datasheet-30459151.pdf?src-supplier=Seeed+Studio; ComponentLink17Description: https://datasheet.octopart.com:443/RC0603FR-0720KL-Yageo-datasheet-30459151.pdf?src-supplier=Seeed+Studio; ComponentLink18URL: https://datasheet.octopart.com:443/RC0603FR-0720KL-Yageo-datasheet-118562.pdf?src-supplier=DigiKey; ComponentLink18Description: https://datasheet.octopart.com:443/RC0603FR-0720KL-Yageo-datasheet-118562.pdf?src-supplier=DigiKey; ComponentLink19URL: http://sigma.octopart.com:80/conflict_mineral_statement/Yageo-company-3.pdf?src-supplier=Compliance+Statements; ComponentLink19Description: http://sigma.octopart.com:80/conflict_mineral_statement/Yageo-company-3.pdf?src-supplier=Compliance+Statements; ComponentLink20URL: http://sigma.octopart.com:80/rohs_statement/Yageo-company-2.pdf?src-supplier=Compliance+Statements; ComponentLink20Description: http://sigma.octopart.com:80/rohs_statement/Yageo-company-2.pdf?src-supplier=Compliance+Statements
RS1 = PMR100HZPFU8L00: Res Current Sense Thick Film 2512 8m Ohm 1% 2W Molded Emboss T/R; Manufacturer: ROHM; Temperature Coefficient: 100ppm/°C; Supplier: Arrow Electronics; Supplier Part Number: PMR100HZPFU8L00; Manufacturer Part Number: PMR100HZPFU8L00; RoHS: Compliant; Category: Chip SMD Resistors; Stock: 5; Pricing: 1=0,0146 (USD); Case/Package: 2512; Height: 320µm; Lead Free: Lead Free; Length: 6.4mm; Lifecycle Status: Production; Max Operating Temperature: 155°C; Min Operating Temperature: -55°C; Mounting Technology: Surface Mount; Number of Terminals: 2; Packaging: Cut Tape; Power Rating: 2W; REACH SVHC: Yes; Schedule B: 8533210045, 8533210045|8533210045, 8533210045|8533210045|8533210045, 8533210045|8533210045|8533210045|8533210045; Tolerance: 1%; Width: 3.2mm; ComponentLink1URL: https://datasheet.octopart.com:443/PMR100HZPFU8L00-ROHM-datasheet-182147691.pdf?src-supplier=IHS; ComponentLink1Description: https://datasheet.octopart.com:443/PMR100HZPFU8L00-ROHM-datasheet-182147691.pdf?src-supplier=IHS; ComponentLink2URL: https://datasheet.octopart.com:443/PMR100HZPFU8L00-Rohm-datasheet-70730905.pdf?src-supplier=Newark; ComponentLink2Description: https://datasheet.octopart.com:443/PMR100HZPFU8L00-Rohm-datasheet-70730905.pdf?src-supplier=Newark; ComponentLink3URL: https://datasheet.octopart.com:443/PMR100HZPFU8L00-Rohm-datasheet-115132289.pdf?src-supplier=Future+Electronics; ComponentLink3Description: https://datasheet.octopart.com:443/PMR100HZPFU8L00-Rohm-datasheet-115132289.pdf?src-supplier=Future+Electronics; ComponentLink4URL: https://datasheet.octopart.com:443/PMR100HZPFU8L00-Rohm-datasheet-79607662.pdf?src-supplier=Future+Electronics; ComponentLink4Description: https://datasheet.octopart.com:443/PMR100HZPFU8L00-Rohm-datasheet-79607662.pdf?src-supplier=Future+Electronics; ComponentLink5URL: https://datasheet.octopart.com:443/PMR100HZPFU8L00-Rohm-datasheet-13297471.pdf?src-supplier=Future+Electronics; ComponentLink5Description: https://datasheet.octopart.com:443/PMR100HZPFU8L00-Rohm-datasheet-13297471.pdf?src-supplier=Future+Electronics; ComponentLink6URL: https://datasheet.octopart.com:443/PMR100HZPFU8L00-Rohm-datasheet-12511488.pdf?src-supplier=Future+Electronics; ComponentLink6Description: https://datasheet.octopart.com:443/PMR100HZPFU8L00-Rohm-datasheet-12511488.pdf?src-supplier=Future+Electronics; ComponentLink7URL: https://datasheet.octopart.com:443/PMR100HZPFU8L00-Rohm-datasheet-12525732.pdf?src-supplier=Future+Electronics; ComponentLink7Description: https://datasheet.octopart.com:443/PMR100HZPFU8L00-Rohm-datasheet-12525732.pdf?src-supplier=Future+Electronics; ComponentLink8URL: https://datasheet.octopart.com:443/PMR100HZPFU8L00-Rohm-datasheet-12543072.pdf?src-supplier=Future+Electronics; ComponentLink8Description: https://datasheet.octopart.com:443/PMR100HZPFU8L00-Rohm-datasheet-12543072.pdf?src-supplier=Future+Electronics
U1 = LM5176PWPR: 55V wide VIN synchronous 4-switch buck-boost controller 28-HTSSOP -40 to 125; Manufacturer: Texas Instruments; Manufacturer Lifecycle Status: ACTIVE; Supplier: Mouser; Supplier Part Number: 595-LM5176PWPR; Manufacturer Part Number: LM5176PWPR; RoHS: Compliant; Category: Integrated Circuits (ICs); Pricing: 1=7,76, 10=6,01, 50=5,57, 100=5,09, 1000=4,6, 10000=4,49 (USD); Height: 1.2mm; Length: 9.7mm; Lifecycle Status: Production; Max Operating Temperature: 125°C; Min Operating Temperature: -40°C; Pins: 28; Schedule B: 8542390000, 8542390000|8542390000|8542390000|8542390000|8542390000; Thickness: 1mm; Topology: Buck-Boost; Width: 4.4mm; ComponentLink1URL: https://sigma.octopart.com:443/149651771/technical_drawing/Texas-Instruments-LM5176PWPR.pdf?src-supplier=Texas+Instruments; ComponentLink1Description: https://sigma.octopart.com:443/149651771/technical_drawing/Texas-Instruments-LM5176PWPR.pdf?src-supplier=Texas+Instruments; ComponentLink2URL: https://octopart.com:443/opatz8j6/c1?t=VRVCafI7s4bG6Zztb8L5r4sLVycBteGLKy5QNf2tGBRTrExigyXOC3PxYErzrsW-NWfD2akeI0Mwe2lBl-DnnI-aA4uHqNyZ5fJqmZ0gkornEqr1DphlO8x3EFdGiIoRxV-N_ppNlyskWHdhRPH9UFmqZ5vi8bQwXlyuc7Nt_alLaVBSszRnRlwkze-xCxAhCGWBAN-Y4Gck8wVEadC_CYKFUFw2xfWVguqijkFkfTQnnUqPAM6sWVKoaOeIfvvRLiDyuYhKva3w8gyjtartpVG7eUF3NFqkx_slddxatLizdWKM18OUpNkaXntHx7Rl8YrZdbA-8oy12CfJVVs4hKkeON3tTWmjAb9cDMFPN-JuPjzhCn8fsFGdUAdgH2v9CWvG&src-supplier=Texas+Instruments; ComponentLink2Description: https://octopart.com:443/opatz8j6/c1?t=VRVCafI7s4bG6Zztb8L5r4sLVycBteGLKy5QNf2tGBRTrExigyXOC3PxYErzrsW-NWfD2akeI0Mwe2lBl-DnnI-aA4uHqNyZ5fJqmZ0gkornEqr1DphlO8x3EFdGiIoRxV-N_ppNlyskWHdhRPH9UFmqZ5vi8bQwXlyuc7Nt_alLaVBSszRnRlwkze-xCxAhCGWBAN-Y4Gck8wVEadC_CYKFUFw2xfWVguqijkFkfTQnnUqPAM6sWVKoaOeIfvvRLiDyuYhKva3w8gyjtartpVG7eUF3NFqkx_slddxatLizdWKM18OUpNkaXntHx7Rl8YrZdbA-8oy12CfJVVs4hKkeON3tTWmjAb9cDMFPN-JuPjzhCn8fsFGdUAdgH2v9CWvG&src-supplier=Texas+Instruments; ComponentLink3URL: https://sigma.octopart.com:443/49250896/technical_drawing/Texas-Instruments-LM5176PWPR.pdf?src-supplier=Texas+Instruments; ComponentLink3Description: https://sigma.octopart.com:443/49250896/technical_drawing/Texas-Instruments-LM5176PWPR.pdf?src-supplier=Texas+Instruments; ComponentLink4URL: http://sigma.octopart.com:80/reach_statement/Texas-Instruments-company-64.pdf?src-supplier=Compliance+Statements; ComponentLink4Description: http://sigma.octopart.com:80/reach_statement/Texas-Instruments-company-64.pdf?src-supplier=Compliance+Statements; ComponentLink5URL: http://sigma.octopart.com:80/conflict_mineral_statement/Texas-Instruments-company-63.pdf?src-supplier=Compliance+Statements; ComponentLink5Description: http://sigma.octopart.com:80/conflict_mineral_statement/Texas-Instruments-company-63.pdf?src-supplier=Compliance+Statements

## Sheet 12V_9V_Power_Stage.SchDoc
size 431 x 279 mm; Organization: ORGANIZATION; Address1: ADDRESS 1; Address2: ADDRESS 2; Address3: ADDRESS 3; Address4: ADDRESS 4; Revision: -; SheetNumber: 4; SheetTotal: 6; ENG_APP_DATE: --/--/--; DSN_APP_DATE: --/--/--; CHK_APP_DATE: --/--/--
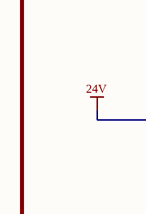
[diagram p3: 12V_9V_Power_Stage.SchDoc, left]
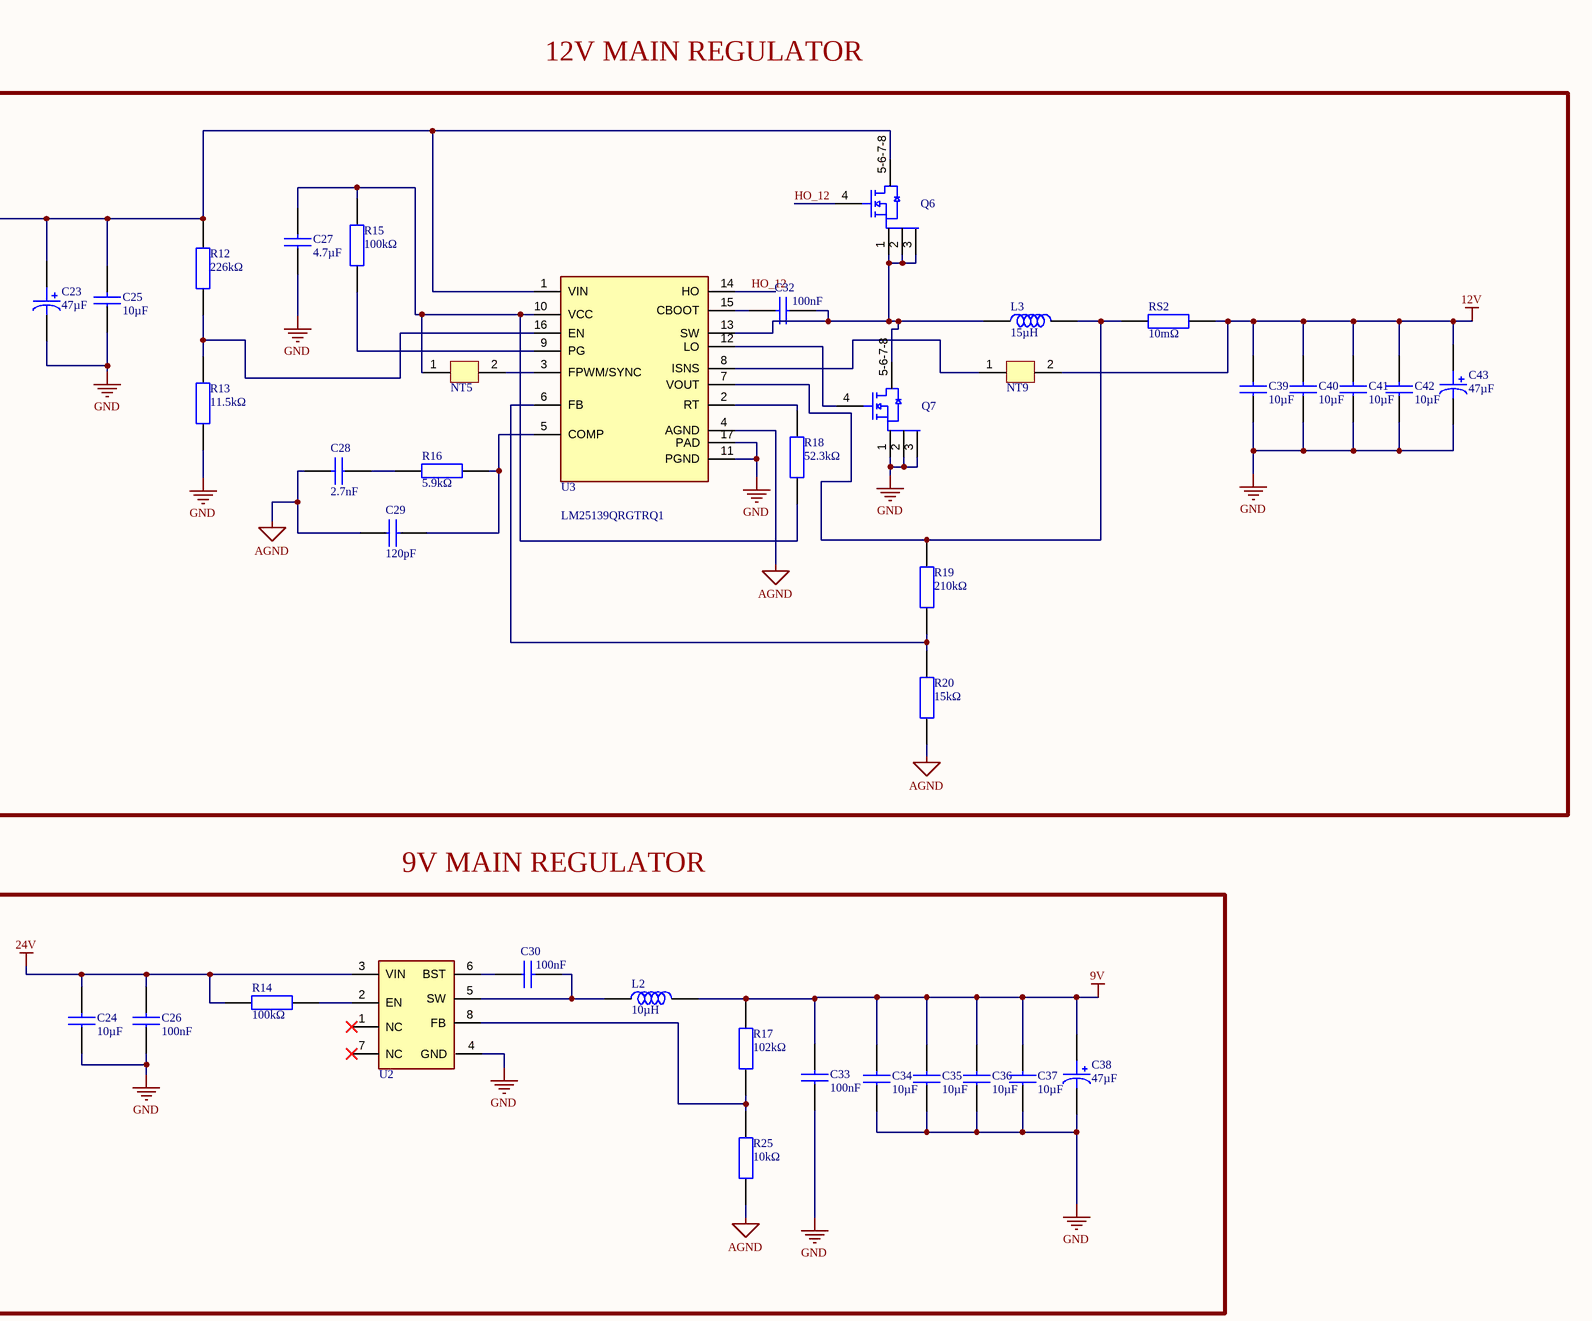
[diagram p4: 12V_9V_Power_Stage.SchDoc, right]

### Parts
C23  value 47µF  [CAP ALUM SMD]  (hidden comment: EEHZA1H470P)
C24  value 10µF  [CAP_1210_S]  (hidden comment: CL32A106KBJNNNE)
C25  value 10µF  [CAP_1206]  (hidden comment: C3216X7R1H106K160AC)
C26  value 100nF  [CAP_0603]  (hidden comment: CGA3E2X7R1H104K080AA)
C27  value 4.7µF  [CAP_0805]  (hidden comment: LMK212B7475KG-T)
C28  value 2.7nF  [CAP_0603]  (hidden comment: GRM1885C1H272JA01J)
C29  value 120pF  [CAP_0402]  (hidden comment: UMK105CG121JV-F)
C30  value 100nF  [CAP_0402]  (hidden comment: C0603X5R1A104K030BC)
C32  value 100nF  [CAP_0402]  (hidden comment: GRM155R71A104KA01D)
C33  value 100nF  [CAP_0603]  (hidden comment: CGA3E2X7R1H104K080AA)
C34  value 10µF  [CAP_1206]  (hidden comment: GRM31CR71E106KA12L)
C35  value 10µF  [CAP_1206]  (hidden comment: GRM31CR71E106KA12L)
C36  value 10µF  [CAP_1206]  (hidden comment: GRM31CR71E106KA12L)
C37  value 10µF  [CAP_1206]  (hidden comment: GRM31CR71E106KA12L)
C38  value 47µF  [CAP ALUM SMD]  (hidden comment: EEHZA1H470P)
C39  value 10µF  [CAP_1206]  (hidden comment: GRM31CR71E106KA12L)
C40  value 10µF  [CAP_1206]  (hidden comment: GRM31CR71E106KA12L)
C41  value 10µF  [CAP_1206]  (hidden comment: GRM31CR71E106KA12L)
C42  value 10µF  [CAP_1206]  (hidden comment: GRM31CR71E106KA12L)
C43  value 47µF  [CAP ALUM SMD]  (hidden comment: EEHZA1H470P)
L2  value 10µH  [SRR1208]  (hidden comment: SRR1208-100ML)
L3  value 15µH  [MSS1210]  (hidden comment: MSS1210-153MED)
NT5  Net-Tie  [Net-Tie]  (value not drawn)  (net tie, no BOM)
NT9  Net-Tie  [Net-Tie]  (value not drawn)  (net tie, no BOM)
Q6  CSD18540Q5B  [SON 5X6]  (value not drawn)
Q7  CSD18540Q5B  [SON 5X6]  (value not drawn)
R12  value 226kΩ  [RES_0402]  (hidden comment: CRCW0402226KFKED)
R13  value 11.5kΩ  [RES_0402]  (hidden comment: CRCW040211K5FKED)
R14  value 100kΩ  [RES_0603]  (hidden comment: CRCW0603100KFKEA)
R15  value 100kΩ  [RES_0603]  (hidden comment: CRCW0603100KFKEA)
R16  value 5.9kΩ  [RES_0402]  (hidden comment: CRCW04025K90FKED)
R17  value 102kΩ  [RES_0402]  (hidden comment: CRCW0402102KFKED)
R18  value 52.3kΩ  [RES_0603]  (hidden comment: CRCW060352K3FKEA)
R19  value 210kΩ  [RES_0402]  (hidden comment: CRCW0402210KFKED)
R20  value 15kΩ  [RES_0402]  (hidden comment: CRCW040215K0FKED)
R25  value 10kΩ  [RES_0402]  (hidden comment: CRCW040210K0FKED)
RS2  value 10mΩ  [CAP_1206]  (hidden comment: CSR1206FK10L0)
U2  TPS563300DRLR  [SOT-583-8]  (value not drawn)
U3  LM25139QRGTRQ1  [16-VFQFN]

### Blocks framed on the sheet
9V MAIN REGULATOR: C24 C26 C30 C33-C38 L2 R14 R17 R25 U2

### Nets
9V: C33.2 C34.2 C35.2 C36.2 C37.2 C38.1(C) L2.2 R17.2
12V: C39.2 C40.2 C41.2 C42.2 C43.1(C) NT9.2 RS2.2
24V: C23.1(C) C24.2 C25.2 C26.2 Q6.5-6-7-8(D) R12.2 R14.1 U2.3(VIN) U3.1(VIN)
AGND: C28.2 C29.1 R20.1 R25.1 U3.4(AGND)
GND: C23.2(A) C24.1 C25.1 C26.1 C27.1 C33.1 C34.1 C35.1 C36.1 C37.1 C38.2(A) C39.1 C40.1 C41.1 C42.1 C43.2(A) Q7.1(S) Q7.2(S) Q7.3(S) R13.1 U2.4(GND) U3.11(PGND) U3.17(PAD)
HO_12: Q6.4(G) U3.14(HO)
NetC27_2: C27.2 NT5.1 R15.2 R18.1 U3.10(VCC)
NetC28_1: C28.1 R16.1
NetC29_2: C29.2 R16.2 U3.5(COMP)
NetC30_1: C30.1 U2.6(BST)
NetC30_2: C30.2 L2.1 U2.5(SW)
NetC32_1: C32.1 L3.1 Q6.1(S) Q6.2(S) Q6.3(S) Q7.5-6-7-8(D) U3.13(SW)
NetC32_2: C32.2 U3.15(CBOOT)
NetL3_2: L3.2 R19.2 RS2.1 U3.7(VOUT)
NetNT5_2: NT5.2 U3.3(FPWM/SYNC)
NetNT9_1: NT9.1 U3.8(ISNS)
NetQ7_4: Q7.4(G) U3.12(LO)
NetR12_1: R12.1 R13.2 U3.16(EN)
NetR14_2: R14.2 U2.2(EN)
NetR15_1: R15.1 U3.9(PG)
NetR17_1: R17.1 R25.2 U2.8(FB)
NetR18_2: R18.2 U3.2(RT)
NetR19_1: R19.1 R20.2 U3.6(FB)

Not connected (* = marked no-connect by the designer): U2 1(NC)* 7(NC)*

### Notes on the sheet
- 12V MAIN REGULATOR
- DWG. NO.
- REV.
- SHT.
- THIS DOCUMENT AND THE DATA DISCLOSED HEREIN OR HEREWITH IS THE PROPERTY OF ALTIUM LIMITED AND MAY BE FREELY DISTRIBUTED IN WHOLE. NO RIGHTS ARE RESERVED OR EXPRESS OR IMPLIED WARANTEE GIVEN.
- REVISION
- DESCRIPTION
- DATE
- APPROVED
- ENG:
- DSN:
- APPROVALS
- PROJECT REVISION:
- www.altium.com <http://www.altium.com>
- DOCUMENT REVISION:
- 92037, La Jolla
- USA
- Altium Ltd.
- 4225 Executive Square
- CHK:
- REFERENCE DOCUMENTS
- DESIGN ITEM:
- TITLE
- VARIANT
- BOM:
- FAB DWG:
- PCB DWG:
- ASSY DWG:
- SCALE:
- SIZE
- B
- CAGE CODE
- FILE NAME
- DWG NO.
- SHEET
- OF
- REV